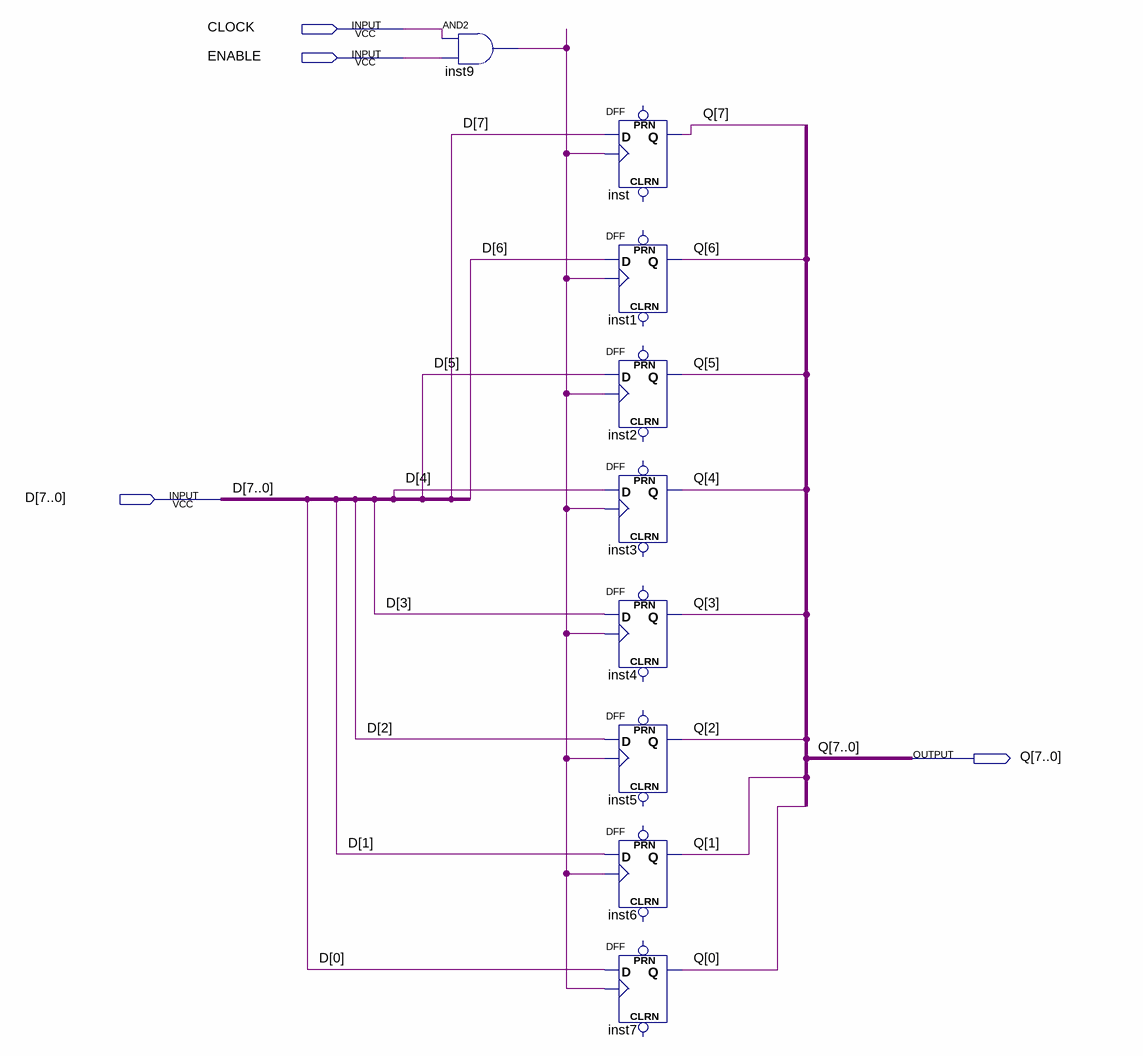
[diagram p0: schematic sheet]
// Quartus schematic register_8bit.bdf as structural Verilog: 9 symbols, 4 pins
module register_8bit (
  input  CLOCK,
  input  ENABLE,
  input  [7:0] D,
  output [7:0] Q
);

  wire inst9_out;

  and inst9 (inst9_out, CLOCK, ENABLE);
  DFF inst (.CLK(inst9_out), .D(D[7]), .Q(Q[7]));  // open: CLRN, PRN
  DFF inst1 (.CLK(inst9_out), .D(D[6]), .Q(Q[6]));  // open: CLRN, PRN
  DFF inst2 (.CLK(inst9_out), .D(D[5]), .Q(Q[5]));  // open: CLRN, PRN
  DFF inst3 (.CLK(inst9_out), .D(D[4]), .Q(Q[4]));  // open: CLRN, PRN
  DFF inst4 (.CLK(inst9_out), .D(D[3]), .Q(Q[3]));  // open: CLRN, PRN
  DFF inst5 (.CLK(inst9_out), .D(D[2]), .Q(Q[2]));  // open: CLRN, PRN
  DFF inst6 (.CLK(inst9_out), .D(D[1]), .Q(Q[1]));  // open: CLRN, PRN
  DFF inst7 (.CLK(inst9_out), .D(D[0]), .Q(Q[0]));  // open: CLRN, PRN
endmodule
